# Altium schematic sheet pay-led-pcb-lorna-v2.SchDoc: pay-led-pcb
size A4; DrawnBy: Lorna Lan; Organization: UTAT; Revision: v2.0; SheetNumber: 1; SheetTotal: 1
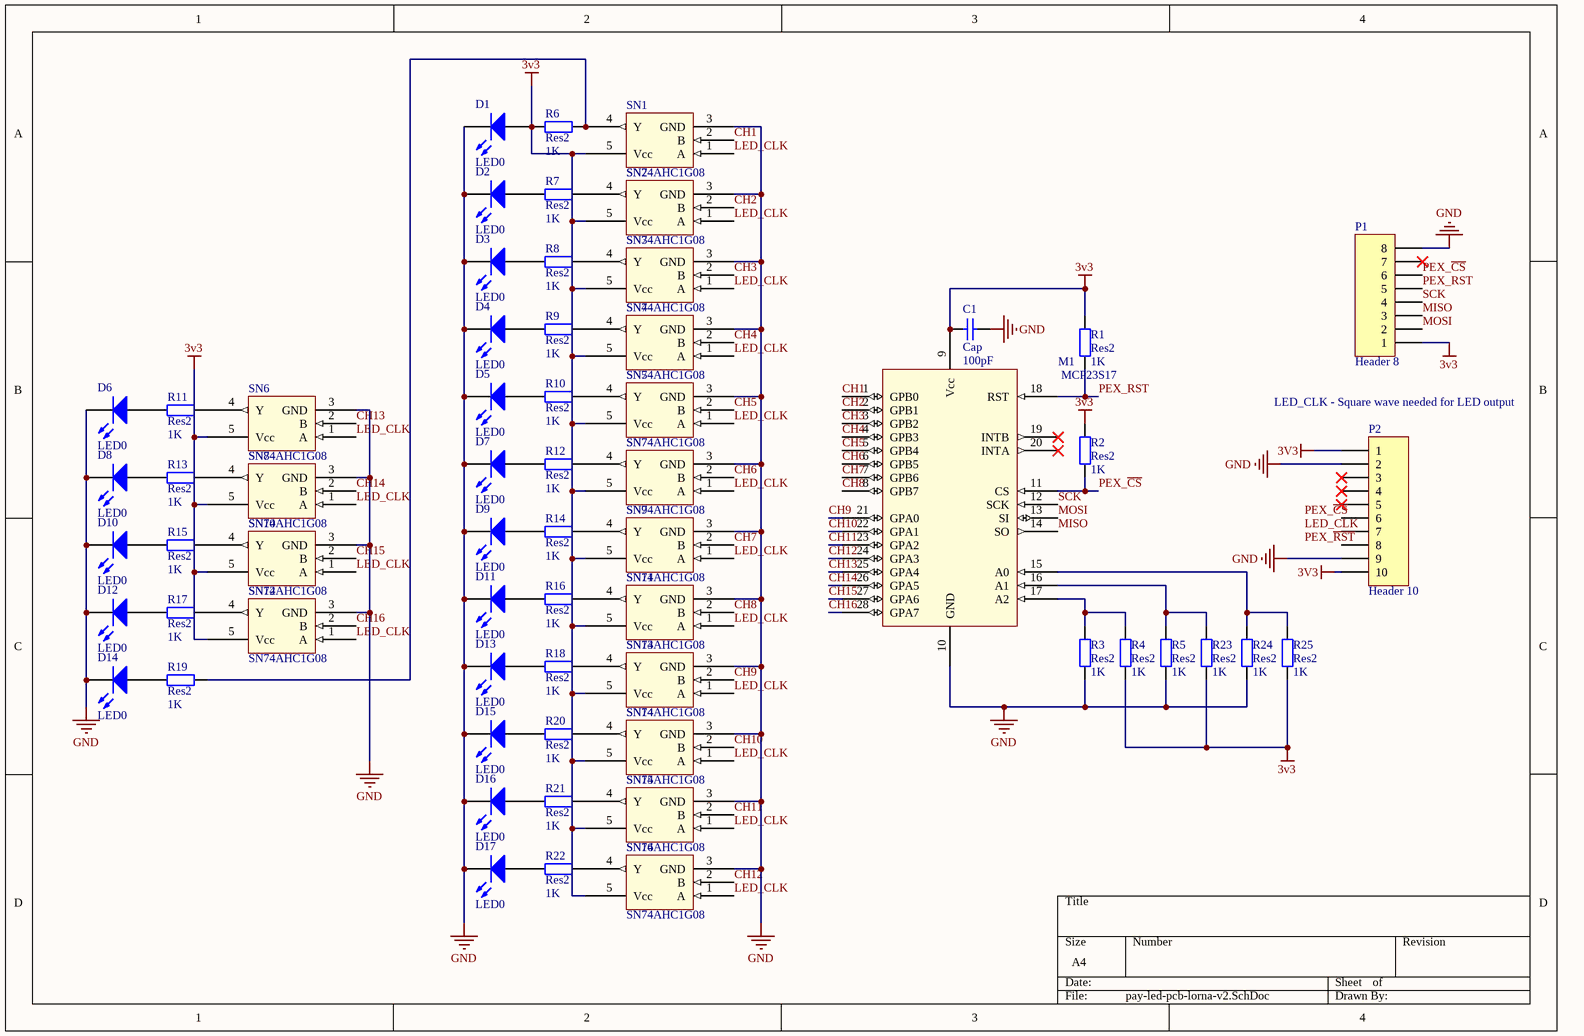
[diagram p0: pay-led-pcb-lorna-v2.SchDoc]

## Parts
C1  Cap  value 100pF  [RAD-0.3]
D1  LED0  [LB P4SG]
D2  LED0  [LB P4SG]
D3  LED0  [LB P4SG]
D4  LED0  [LB P4SG]
D5  LED0  [LB P4SG]
D6  LED0  [LB P4SG]
D7  LED0  [LB P4SG]
D8  LED0  [LB P4SG]
D9  LED0  [LB P4SG]
D10  LED0  [LB P4SG]
D11  LED0  [LB P4SG]
D12  LED0  [LB P4SG]
D13  LED0  [LB P4SG]
D14  LED0  [LB P4SG]
D15  LED0  [LB P4SG]
D16  LED0  [LB P4SG]
D17  LED0  [LB P4SG]
M1  MCP23S17  [SOIC127P030X265-28N]
P1  Header 8  [HDR1X8]
P2  Header 10  [HDR1X10]
R1  Res2  value 1K  [AXIAL-0.4]
R2  Res2  value 1K  [AXIAL-0.4]
R3  Res2  value 1K  [AXIAL-0.4]
R4  Res2  value 1K  [AXIAL-0.4]
R5  Res2  value 1K  [AXIAL-0.4]
R6  Res2  value 1K  [AXIAL-0.4]
R7  Res2  value 1K  [AXIAL-0.4]
R8  Res2  value 1K  [AXIAL-0.4]
R9  Res2  value 1K  [AXIAL-0.4]
R10  Res2  value 1K  [AXIAL-0.4]
R11  Res2  value 1K  [AXIAL-0.4]
R12  Res2  value 1K  [AXIAL-0.4]
R13  Res2  value 1K  [AXIAL-0.4]
R14  Res2  value 1K  [AXIAL-0.4]
R15  Res2  value 1K  [AXIAL-0.4]
R16  Res2  value 1K  [AXIAL-0.4]
R17  Res2  value 1K  [AXIAL-0.4]
R18  Res2  value 1K  [AXIAL-0.4]
R19  Res2  value 1K  [AXIAL-0.4]
R20  Res2  value 1K  [AXIAL-0.4]
R21  Res2  value 1K  [AXIAL-0.4]
R22  Res2  value 1K  [AXIAL-0.4]
R23  Res2  value 1K  [AXIAL-0.4]
R24  Res2  value 1K  [AXIAL-0.4]
R25  Res2  value 1K  [AXIAL-0.4]
SN1  SN74AHC1G08  [SOT-23-5_95P290X160-5N]
SN2  SN74AHC1G08  [SOT-23-5_95P290X160-5N]
SN3  SN74AHC1G08  [SOT-23-5_95P290X160-5N]
SN4  SN74AHC1G08  [SOT-23-5_95P290X160-5N]
SN5  SN74AHC1G08  [SOT-23-5_95P290X160-5N]
SN6  SN74AHC1G08  [SOT-23-5_95P290X160-5N]
SN7  SN74AHC1G08  [SOT-23-5_95P290X160-5N]
SN8  SN74AHC1G08  [SOT-23-5_95P290X160-5N]
SN9  SN74AHC1G08  [SOT-23-5_95P290X160-5N]
SN10  SN74AHC1G08  [SOT-23-5_95P290X160-5N]
SN11  SN74AHC1G08  [SOT-23-5_95P290X160-5N]
SN12  SN74AHC1G08  [SOT-23-5_95P290X160-5N]
SN13  SN74AHC1G08  [SOT-23-5_95P290X160-5N]
SN14  SN74AHC1G08  [SOT-23-5_95P290X160-5N]
SN15  SN74AHC1G08  [SOT-23-5_95P290X160-5N]
SN16  SN74AHC1G08  [SOT-23-5_95P290X160-5N]

## Nets
3v3: C1.1 D1.1(A) M1.9(Vcc) P1.1 P2.1 P2.10 R1.1 R2.1 R4.1 R6.1 R23.1 R25.1 SN1.5(Vcc) SN2.5(Vcc) SN3.5(Vcc) SN4.5(Vcc) SN5.5(Vcc) SN6.5(Vcc) SN7.5(Vcc) SN8.5(Vcc) SN9.5(Vcc) SN10.5(Vcc) SN11.5(Vcc) SN12.5(Vcc) SN13.5(Vcc) SN14.5(Vcc) SN15.5(Vcc) SN16.5(Vcc)
GND: C1.2 D1.2(K) D2.2(K) D3.2(K) D4.2(K) D5.2(K) D6.2(K) D7.2(K) D8.2(K) D9.2(K) D10.2(K) D11.2(K) D12.2(K) D13.2(K) D14.2(K) D15.2(K) D16.2(K) D17.2(K) M1.10(GND) P1.8 P2.2 P2.9 R3.1 R5.1 R24.1 SN1.3(GND) SN2.3(GND) SN3.3(GND) SN4.3(GND) SN5.3(GND) SN6.3(GND) SN7.3(GND) SN8.3(GND) SN9.3(GND) SN10.3(GND) SN11.3(GND) SN12.3(GND) SN13.3(GND) SN14.3(GND) SN15.3(GND) SN16.3(GND)
CH1: M1.1(GPB0) SN1.2(B)
CH2: M1.2(GPB1) SN2.2(B)
CH3: M1.3(GPB2) SN3.2(B)
CH4: M1.4(GPB3) SN4.2(B)
CH5: M1.5(GPB4) SN5.2(B)
CH6: M1.6(GPB5) SN7.2(B)
CH7: M1.7(GPB6) SN9.2(B)
CH8: M1.8(GPB7) SN11.2(B)
CH9: M1.21(GPA0) SN13.2(B)
CH10: M1.22(GPA1) SN14.2(B)
CH11: M1.23(GPA2) SN15.2(B)
CH12: M1.24(GPA3) SN16.2(B)
CH13: M1.25(GPA4) SN6.2(B)
CH14: M1.26(GPA5) SN8.2(B)
CH15: M1.27(GPA6) SN10.2(B)
CH16: M1.28(GPA7) SN12.2(B)
LED_CLK: SN1.1(A) SN2.1(A) SN3.1(A) SN4.1(A) SN5.1(A) SN6.1(A) SN7.1(A) SN8.1(A) SN9.1(A) SN10.1(A) SN11.1(A) SN12.1(A) SN13.1(A) SN14.1(A) SN15.1(A) SN16.1(A)
MISO: M1.14(SO) P1.3
MOSI: M1.13(SI) P1.2
PEX_~{CS}: M1.11(CS) P1.6 R2.2
PEX_RST: M1.18(RST) P1.5 R1.2
SCK: M1.12(SCK) P1.4
NetD2_1: D2.1(A) R7.1
NetD3_1: D3.1(A) R8.1
NetD4_1: D4.1(A) R9.1
NetD5_1: D5.1(A) R10.1
NetD6_1: D6.1(A) R11.1
NetD7_1: D7.1(A) R12.1
NetD8_1: D8.1(A) R13.1
NetD9_1: D9.1(A) R14.1
NetD10_1: D10.1(A) R15.1
NetD11_1: D11.1(A) R16.1
NetD12_1: D12.1(A) R17.1
NetD13_1: D13.1(A) R18.1
NetD14_1: D14.1(A) R19.1
NetD15_1: D15.1(A) R20.1
NetD16_1: D16.1(A) R21.1
NetD17_1: D17.1(A) R22.1
NetM1_15: M1.15(A0) R24.2 R25.2
NetM1_16: M1.16(A1) R5.2 R23.2
NetM1_17: M1.17(A2) R3.2 R4.2
NetR6_2: R6.2 R19.2 SN1.4(Y)
NetR7_2: R7.2 SN2.4(Y)
NetR8_2: R8.2 SN3.4(Y)
NetR9_2: R9.2 SN4.4(Y)
NetR10_2: R10.2 SN5.4(Y)
NetR11_2: R11.2 SN6.4(Y)
NetR12_2: R12.2 SN7.4(Y)
NetR13_2: R13.2 SN8.4(Y)
NetR14_2: R14.2 SN9.4(Y)
NetR15_2: R15.2 SN10.4(Y)
NetR16_2: R16.2 SN11.4(Y)
NetR17_2: R17.2 SN12.4(Y)
NetR18_2: R18.2 SN13.4(Y)
NetR20_2: R20.2 SN14.4(Y)
NetR21_2: R21.2 SN15.4(Y)
NetR22_2: R22.2 SN16.4(Y)

Not connected (* = marked no-connect by the designer): M1 19(INTB)* 20(INTA)*; P1 7*; P2 3* 4* 5* 6 7 8

## Notes on the sheet
- LED_CLK - Square wave needed for LED output
- Labels drawn without touching a wire or pin: LED_CLK, PEX_~{CS}, PEX_~{RST}

## Library data of the parts
C1 = Cap: Capacitor; Published: 8-Jun-2000; LatestRevisionDate: 17-Jul-2002; LatestRevisionNote: Re-released for DXP Platform.; PackageReference: RAD-0.3; Publisher: Altium Limited; PackageDescription: Radial Cap, Thru-Hole; 2 Leads; 0.3 in Pin Spacing
D1-D17 = LED0: Typical INFRARED GaAs LED; Published: 8-Jun-2000; LatestRevisionDate: 08-Jul-2005; LatestRevisionNote: Mech Layer 1 removed.; PackageReference: LED-0; Publisher: Altium Limited; PackageDescription: LED; 2 Leads
P1 = Header 8: Header, 8-Pin; LatestRevisionDate: 17-Jul-2002; LatestRevisionNote: Re-released for DXP Platform.; Publisher: Altium Limited
P2 = Header 10: Header, 10-Pin; LatestRevisionDate: 17-Jul-2002; LatestRevisionNote: Re-released for DXP Platform.; Publisher: Altium Limited
R1-R25 = Res2: Resistor; Published: 8-Jun-2000; LatestRevisionDate: 17-Jul-2002; LatestRevisionNote: Re-released for DXP Platform.; PackageReference: AXIAL-0.4; Publisher: Altium Limited; PackageDescription: Axial Device, Thru-Hole; 2 Leads; 0.4 in Pin Spacing